# Altium schematic sheet Power.SchDoc: 5R Supply
size Tabloid; DocumentNumber: LM-008; Revision: C; SheetNumber: 3; SheetTotal: 6
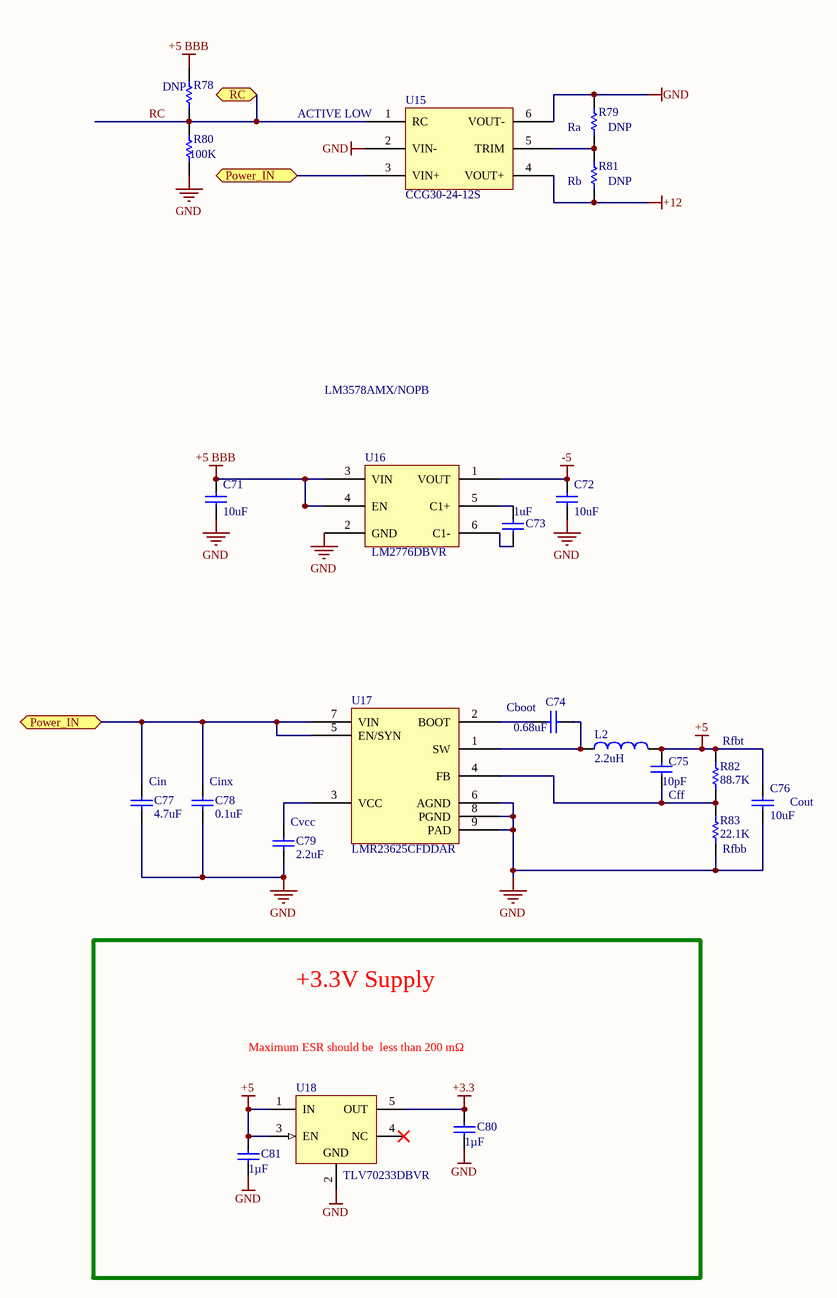
[diagram p0: Power.SchDoc]

## Parts
C71  10uF  [CAPC0805(2012)145_N]
C72  10uF  [CAPC0805(2012)145_N]
C73  1uF  [CAPC0805(2012)145_N]
C74  0.68uF  [1608[0603]]
C75  10pF  [CAPC0805(2012)145_N]
C76  10uF  [CAPC0805(2012)145_N]
C77  4.7uF  [C1210]
C78  0.1uF  [1608[0603]]
C79  2.2uF  [1608[0603]]
C80  Capacitance: 1µF  [CAPC1206(3216)130_N]  (hidden comment: CAP CER 1UF 50V X7R 1210)
C81  Capacitance: 1µF  [CAPC1206(3216)130_N]  (hidden comment: CAP CER 1UF 50V X7R 1210)
L2  2.2uH  [PA4332]
R78  DNP  [RESC0805(2012)_M]
R79  DNP  [RESC0805(2012)_M]
R80  Resistance: 100K  [RESC0805(2012)_M]  (hidden comment: RES SMD 100K OHM 1% 1/8W 0805)
R81  DNP  [RESC0805(2012)_M]
R82  88.7K  [RESC0805(2012)_M]
R83  22.1K  [RESC0805(2012)_M]
U15  CCG30-24-12S  [PXB15-24WD05/N]
U16  LM2776DBVR  [LM2776DBVR]
U17  LMR23625CFDDAR  [LMR23625CDDAR]
U18  TLV70233DBVR  [DBV0005A_N]

## Blocks framed on the sheet
+3.3V Supply: C80 C81 U18

## Ports
Power_IN, RC

## Nets
+3.3: C80.2 U18.5(OUT)
+5: C75.1 C76.1 C81.2 L2.2 R82.2 U18.1(IN) U18.3(EN)
+5 BBB: C71.1 R78.1 U16.3(VIN) U16.4(EN)
+12: R81.1 U15.4(VOUT+)
-5: C72.1 U16.1(VOUT)
GND: C71.2 C72.2 C76.2 C77.1 C78.1 C79.1 C80.1 C81.1 R79.2 R80.2 R83.1 U15.2(VIN-) U15.6(VOUT-) U16.2(GND) U17.6(AGND) U17.8(PGND) U17.9(PAD) U18.2(GND)
Power_IN: C77.2 C78.2 U15.3(VIN+) U17.5(EN/SYN) U17.7(VIN) ; port Power_IN
RC: R78.2 R80.1 U15.1(RC) ; port RC
NetC73_1: C73.1 U16.5(C1+)
NetC73_2: C73.2 U16.6(C1-)
NetC74_1: C74.1 U17.2(BOOT)
NetC74_2: C74.2 L2.1 U17.1(SW)
NetC75_2: C75.2 R82.1 R83.2 U17.4(FB)
NetC79_2: C79.2 U17.3(VCC)
NetR79_1: R79.1 R81.2 U15.5(TRIM)

Not connected (* = marked no-connect by the designer): U18 4(NC)*

## Notes on the sheet
- (near U15) ACTIVE LOW
- (near R79) Ra
- (near R81) Rb
- LM3578AMX/NOPB
- (near C74) Cboot
- (near R82) Rfbt
- (near C77) Cin
- (near C78) Cinx
- (near C79) Cvcc
- (near C75) Cff
- (near C76) Cout
- (near R83) Rfbb
- Maximum ESR should be  less than 200 mΩ
- Title
- Size:
- Date:
- Tabloid
- Number:
- Time:
- Revision:
- Sheet
- of
- ZLS Corporation
- 7801 North Lamar Blvd.
- Suite E-184
- Austin, Texas 78752  USA
- (512) 453-0288
- File:

## Library data of the parts
C71 C72 C76 = CMP-1036-04795-1: CAP CER 10UF 16V X6S 0805; Manufacturer: TDK Corporation; Manufacturer Part Number: C2012X6S1C106K085AC; Tolerance: ±10%; Notification: Current market demand for these product types have resulted in fluctuating and extending lead times. Lead times may differ.; Supplier 1: Digi-Key; Supplier Part Number 1: 445-14483-6-ND; RoHS: RoHS Compliant; Category: Capacitors; Stock 1: 0; Pricing 1: 1=0.38, 10=0.259, 100=0.1466, 500=0.1035, 1000=0.09056 (USD); Packaging: Digi-Reel®; Part Status: Active; Voltage - Rated: 16V; Temperature Coefficient: X6S; Operating Temperature: -55°C ~ 105°C; Features: Low ESL; Ratings: -; Applications: General Purpose; Failure Rate: -; Mounting Type: Surface Mount, MLCC; Package / Case: 0805 (2012 Metric); Size / Dimension: 0.079" L x 0.049" W (2.00mm x 1.25mm); Height - Seated (Max): -; Thickness (Max): 0.039" (1.00mm); Lead Spacing: -; Lead Style: -; ComponentLink1URL: https://product.tdk.com/info/en/catalog/datasheets/mlcc_commercial_general_en.pdf; ComponentLink1Description: https://product.tdk.com/info/en/catalog/datasheets/mlcc_commercial_general_en.pdf
C73 = CMP-1036-04795-1: CAP CER 1UF 25V X7R 0805; Manufacturer: Yageo; Manufacturer Part Number: CC0805KKX7R6BB105; Tolerance: ±10%; Voltage - Rated: 10V; Notification: Current market demand for these product types have resulted in fluctuating and extending lead times. Lead times may differ.; Supplier 1: Digi-Key; Supplier Part Number 1: 311-1458-6-ND; RoHS: RoHS Compliant; Category: Capacitors; Stock 1: 30000; Pricing 1: 1=0.25, 10=0.168, 100=0.0852, 500=0.0583, 1000=0.05158 (USD); Packaging: Digi-Reel®; Part Status: Active; Temperature Coefficient: X7R; Operating Temperature: -55°C ~ 125°C; Features: -; Ratings: -; Applications: General Purpose; Failure Rate: -; Mounting Type: Surface Mount, MLCC; Package / Case: 0805 (2012 Metric); Size / Dimension: 0.079" L x 0.049" W (2.00mm x 1.25mm); Height - Seated (Max): -; Thickness (Max): 0.057" (1.45mm); Lead Spacing: -; Lead Style: -; ComponentLink1URL: http://www.yageo.com/documents/recent/UPY-GPHC_X7R_6.3V-to-50V_18.pdf; ComponentLink1Description: http://www.yageo.com/documents/recent/UPY-GPHC_X7R_6.3V-to-50V_18.pdf
C74 = Cap Semi: CAP CER 0.68UF 50V X5R 0603; Manufacturer: TDK Corporation; Manufacturer Part Number: C1608X5R1H684K080AB; Tolerance: ±10%; Notification: Current market demand for these product types have resulted in fluctuating and extending lead times. Lead times may differ.; Supplier 1: Digi-Key; Supplier Part Number 1: 445-7466-6-ND; RoHS: RoHS Compliant; Category: Capacitors; Stock 1: 40000; Pricing 1: 1=0.24, 10=0.162, 100=0.0819, 500=0.05606, 1000=0.04959 (USD); Packaging: Digi-Reel®; Part Status: Not For New Designs; Voltage - Rated: 50V; Temperature Coefficient: X5R; Operating Temperature: -55°C ~ 85°C; Features: Low ESL; Ratings: -; Applications: General Purpose; Failure Rate: -; Mounting Type: Surface Mount, MLCC; Package / Case: 0603 (1608 Metric); Size / Dimension: 0.063" L x 0.032" W (1.60mm x 0.80mm); Height - Seated (Max): -; Thickness (Max): 0.035" (0.90mm); Lead Spacing: -; Lead Style: -; ComponentLink1URL: https://product.tdk.com/info/en/catalog/datasheets/mlcc_commercial_general_en.pdf; ComponentLink1Description: https://product.tdk.com/info/en/catalog/datasheets/mlcc_commercial_general_en.pdf
C75 = CMP-1036-04795-1: CAP CER 10PF 16V C0G/NP0 0805; Manufacturer: KEMET; Manufacturer Part Number: C0805C100M4GACTU; Tolerance: ±20%; Temperature Coefficient: C0G, NP0; Notification: Current market demand for these product types have resulted in fluctuating and extending lead times. Lead times may differ.; Supplier 1: Digi-Key; Supplier Part Number 1: 399-9147-6-ND; RoHS: RoHS Compliant; Category: Capacitors; Stock 1: 7637; Pricing 1: 1=0.13, 10=0.092, 100=0.0409, 500=0.02918, 1000=0.02293 (USD); Packaging: Digi-Reel®; Part Status: Active; Voltage - Rated: 16V; Operating Temperature: -55°C ~ 125°C; Features: Low ESL; Ratings: -; Applications: General Purpose; Failure Rate: -; Mounting Type: Surface Mount, MLCC; Package / Case: 0805 (2012 Metric); Size / Dimension: 0.079" L x 0.049" W (2.00mm x 1.25mm); Height - Seated (Max): -; Thickness (Max): 0.035" (0.88mm); Lead Spacing: -; Lead Style: -; ComponentLink1URL: https://api.kemet.com/component-edge/download/datasheet/C0805C100M4GACTU.pdf; ComponentLink1Description: https://api.kemet.com/component-edge/download/datasheet/C0805C100M4GACTU.pdf
C77 = Cap Semi: CAP CER 4.7UF 50V X7R 1210; Manufacturer: Murata Electronics North America; Manufacturer Part Number: GRM32ER71H475KA88L; Tolerance: ±10%; Notification: Current market demand for these product types have resulted in fluctuating and extending lead times. Lead times may differ.; Published: 8-Jun-2000; LatestRevisionDate: 29-May-2009; LatestRevisionNote: IPC-7351 Footprint Added.; PackageReference: C1206; Publisher: Altium Limited; PackageDescription: Chip Capacitor; Supplier 1: Digi-Key; Supplier Part Number 1: 490-1864-6-ND; RoHS: RoHS Compliant; Category: Capacitors; Stock 1: 10000; Pricing 1: 1=1.66, 10=1.313, 100=0.9849, 500=0.74414 (USD); Packaging: Digi-Reel®; Part Status: Not For New Designs; Voltage - Rated: 50V; Temperature Coefficient: X7R; Operating Temperature: -55°C ~ 125°C; Features: -; Ratings: -; Applications: General Purpose; Mounting Type: Surface Mount, MLCC; Package / Case: 1210 (3225 Metric); Size / Dimension: 0.126" L x 0.098" W (3.20mm x 2.50mm); Height - Seated (Max): -; Thickness (Max): 0.106" (2.70mm); Lead Spacing: -; Lead Style: -; ComponentLink1URL: https://www.murata.com/~/media/webrenewal/support/library/catalog/products/capacitor/mlcc/c02e.ashx?la=en-us; ComponentLink1Description: https://www.murata.com/~/media/webrenewal/support/library/catalog/products/capacitor/mlcc/c02e.ashx?la=en-us
C78 = Cap Semi: CAP CER 0.1UF 50V X5R 0603; Manufacturer: TDK Corporation; Manufacturer Part Number: C1608X5R1H104K080AA; Tolerance: ±10%; Notification: Current market demand for these product types have resulted in fluctuating and extending lead times. Lead times may differ.; Supplier 1: Digi-Key; Supplier Part Number 1: 445-7456-6-ND; RoHS: RoHS Compliant; Category: Capacitors; Stock 1: 0; Pricing 1: 1=0.1, 10=0.074, 100=0.0331, 500=0.02366, 1000=0.0186 (USD); Packaging: Digi-Reel®; Part Status: Not For New Designs; Voltage - Rated: 50V; Temperature Coefficient: X5R; Operating Temperature: -55°C ~ 85°C; Features: Low ESL; Ratings: -; Applications: General Purpose; Failure Rate: -; Mounting Type: Surface Mount, MLCC; Package / Case: 0603 (1608 Metric); Size / Dimension: 0.063" L x 0.032" W (1.60mm x 0.80mm); Height - Seated (Max): -; Thickness (Max): 0.035" (0.90mm); Lead Spacing: -; Lead Style: -; ComponentLink1URL: https://product.tdk.com/info/en/catalog/datasheets/mlcc_commercial_general_en.pdf; ComponentLink1Description: https://product.tdk.com/info/en/catalog/datasheets/mlcc_commercial_general_en.pdf
C79 = Cap Semi: CAP CER 2.2UF 10V X7R 0603
C80 C81 = CMP-1037-04913-1: Manufacturer: Murata Electronics North America; Manufacturer Part Number: GRM32RR71H105KA01L; Tolerance: ±10%; Supplier 1: Digi-Key; Supplier Part Number 1: 490-1863-6-ND; RoHS: RoHS Compliant; Category: Capacitors; Stock 1: 66890; Pricing 1: 1=0.35, 10=0.242, 100=0.1449, 500=0.10868 (USD); Packaging: Digi-Reel®; Part Status: Active; Voltage - Rated: 50V; Temperature Coefficient: X7R; Operating Temperature: -55°C ~ 125°C; Features: -; Ratings: -; Applications: General Purpose; Mounting Type: Surface Mount, MLCC; Package / Case: 1210 (3225 Metric); Size / Dimension: 0.126" L x 0.098" W (3.20mm x 2.50mm); Height - Seated (Max): -; Thickness (Max): 0.079" (2.00mm); Lead Spacing: -; Lead Style: -; ComponentLink1URL: http://search.murata.co.jp/Ceramy/image/img/A01X/G101/ENG/GRM32RR71H105KA01-01.pdf; ComponentLink1Description: http://search.murata.co.jp/Ceramy/image/img/A01X/G101/ENG/GRM32RR71H105KA01-01.pdf
L2 = Inductor: FIXED IND 2.2UH 4.3A 48 MOHM SMD; Manufacturer: Pulse Electronics Power; Manufacturer Part Number: PA4332.222NLT; Type: Wirewound; Material - Core: Iron; Tolerance: ±20%; Current - Saturation: 6.1A; Shielding: Shielded; DC Resistance (DCR): 48 mOhm Max; Frequency - Self Resonant: 25MHz; Supplier 1: Digi-Key; Supplier Part Number 1: 553-3290-6-ND; RoHS: RoHS Compliant; Category: Inductors, Coils, Chokes; Stock 1: 4798; Pricing 1: 1=0.64, 10=0.564, 100=0.4025, 500=0.3381, 1000=0.2737 (USD); Packaging: Digi-Reel®; Part Status: Active; Q @ Freq: -; Ratings: -; Operating Temperature: -40°C ~ 125°C; Features: -; Mounting Type: Surface Mount; Package / Case: Nonstandard; Supplier Device Package: -; Size / Dimension: 0.165" L x 0.165" W (4.20mm x 4.20mm); Height - Seated (Max): 0.079" (2.00mm); ComponentLink1URL: http://products.pulseelex.com/files/product_files/P761.pdf; ComponentLink1Description: http://products.pulseelex.com/files/product_files/P761.pdf
R78 = CMP-1013-00017-1: RES SMD 100K OHM 1% 1/8W 0805; Manufacturer: Vishay; Manufacturer Part Number: CRCW0805100KFKEA; Temperature Coefficient: 100ppm/°C; Power Rating: 125mW; Voltage Rating: 150V; Supplier 1: Avnet; Supplier Part Number 1: CRCW0805100KFKEA/BKN; Stock 1: 1317; Pricing 1: 1=0.1, 10=0.049, 25=0.042, 50=0.035, 100=0.028 (USD); Mount: Surface Mount; Case/Package: 0805; Number of Pins: 2; Weight: 0.000194oz; Contact Plating: Tin; Case Code (Imperial): 0805; Case Code (Metric): 2012; Min Operating Temperature: -55°C; Max Operating Temperature: 155°C; Tolerance: 1%; Composition: Thick Film; Resistance: 100K; Termination: SMD/SMT; Packaging: Tape and Reel; Package Quantity: 5000; Military Standard: Not; Voltage Rating (DC): 150V; Length: 2mm; Height: 0.45mm; Width: 1.25mm; Depth: 1.25mm; Radiation Hardening: No; Lead Free: Lead Free; REACH SVHC: Unknown; ComponentLink1URL: https://datasheet.ciiva.com/11809/0900766b80d98b26-11809057.pdf; ComponentLink1Description: https://datasheet.ciiva.com/11809/0900766b80d98b26-11809057.pdf; ComponentLink2URL: https://datasheet.ciiva.com/7777/1697337-7777349.pdf; ComponentLink2Description: https://datasheet.ciiva.com/7777/1697337-7777349.pdf; ComponentLink3URL: https://datasheet.ciiva.com/3258/dcrcwe3-3258006.pdf; ComponentLink3Description: https://datasheet.ciiva.com/3258/dcrcwe3-3258006.pdf; ComponentLink4URL: https://datasheet.ciiva.com/16754/70201119-16754822.pdf; ComponentLink4Description: https://datasheet.ciiva.com/16754/70201119-16754822.pdf; ComponentLink5URL: https://datasheet.ciiva.com/8337/dcrcwe3-8337738.pdf; ComponentLink5Description: https://datasheet.ciiva.com/8337/dcrcwe3-8337738.pdf; ComponentLink6URL: https://datasheet.ciiva.com/16341/dcrcwe3-16341530.pdf; ComponentLink6Description: https://datasheet.ciiva.com/16341/dcrcwe3-16341530.pdf; ComponentLink7URL: https://datasheet.ciiva.com/16852/dcrcwe3-16852810.pdf; ComponentLink7Description: https://datasheet.ciiva.com/16852/dcrcwe3-16852810.pdf; ComponentLink8URL: https://datasheet.ciiva.com/16720/70201119-16720891.pdf; ComponentLink8Description: https://datasheet.ciiva.com/16720/70201119-16720891.pdf; ComponentLink9URL: https://datasheet.ciiva.com/7777/1720486-7777565.pdf; ComponentLink9Description: https://datasheet.ciiva.com/7777/1720486-7777565.pdf
R79 = CMP-1013-00017-1: Vout = 12.05 ­ (445.7 / 63.1+Ra)
R80 = CMP-1013-00017-1: Manufacturer: Vishay; Manufacturer Part Number: CRCW0805100KFKEA; Temperature Coefficient: 100ppm/°C; Power Rating: 125mW; Voltage Rating: 150V; Supplier 1: Avnet; Supplier Part Number 1: CRCW0805100KFKEA/BKN; Stock 1: 1317; Pricing 1: 1=0.1, 10=0.049, 25=0.042, 50=0.035, 100=0.028 (USD); Mount: Surface Mount; Case/Package: 0805; Number of Pins: 2; Weight: 0.000194oz; Contact Plating: Tin; Case Code (Imperial): 0805; Case Code (Metric): 2012; Min Operating Temperature: -55°C; Max Operating Temperature: 155°C; Tolerance: 1%; Composition: Thick Film; Termination: SMD/SMT; Packaging: Tape and Reel; Package Quantity: 5000; Military Standard: Not; Voltage Rating (DC): 150V; Length: 2mm; Height: 0.45mm; Width: 1.25mm; Depth: 1.25mm; Radiation Hardening: No; Lead Free: Lead Free; REACH SVHC: Unknown; ComponentLink1URL: https://datasheet.ciiva.com/11809/0900766b80d98b26-11809057.pdf; ComponentLink1Description: https://datasheet.ciiva.com/11809/0900766b80d98b26-11809057.pdf; ComponentLink2URL: https://datasheet.ciiva.com/7777/1697337-7777349.pdf; ComponentLink2Description: https://datasheet.ciiva.com/7777/1697337-7777349.pdf; ComponentLink3URL: https://datasheet.ciiva.com/3258/dcrcwe3-3258006.pdf; ComponentLink3Description: https://datasheet.ciiva.com/3258/dcrcwe3-3258006.pdf; ComponentLink4URL: https://datasheet.ciiva.com/16754/70201119-16754822.pdf; ComponentLink4Description: https://datasheet.ciiva.com/16754/70201119-16754822.pdf; ComponentLink5URL: https://datasheet.ciiva.com/8337/dcrcwe3-8337738.pdf; ComponentLink5Description: https://datasheet.ciiva.com/8337/dcrcwe3-8337738.pdf; ComponentLink6URL: https://datasheet.ciiva.com/16341/dcrcwe3-16341530.pdf; ComponentLink6Description: https://datasheet.ciiva.com/16341/dcrcwe3-16341530.pdf; ComponentLink7URL: https://datasheet.ciiva.com/16852/dcrcwe3-16852810.pdf; ComponentLink7Description: https://datasheet.ciiva.com/16852/dcrcwe3-16852810.pdf; ComponentLink8URL: https://datasheet.ciiva.com/16720/70201119-16720891.pdf; ComponentLink8Description: https://datasheet.ciiva.com/16720/70201119-16720891.pdf; ComponentLink9URL: https://datasheet.ciiva.com/7777/1720486-7777565.pdf; ComponentLink9Description: https://datasheet.ciiva.com/7777/1720486-7777565.pdf
R81 = CMP-1013-00017-1: Vout = 12.05 + (50.96 / 22+Rb)
R82 = CMP-1013-00017-1: RES SMD 88.7K OHM 1% 1/8W 0805; Manufacturer: Vishay Dale; Manufacturer Part Number: CRCW080588K7FKEA; Power (Watts): 0.125W, 1/8W; Temperature Coefficient: ±100ppm/°C; Supplier 1: Digi-Key; Supplier Part Number 1: 541-88.7KCDKR-ND; RoHS: RoHS Compliant; Category: Resistors; Stock 1: 66; Pricing 1: 1=0.1, 10=0.055, 100=0.0223, 1000=0.01003, 2500=0.0087 (USD); Packaging: Digi-Reel®; Part Status: Active; Tolerance: ±1%; Composition: Thick Film; Features: Automotive AEC-Q200; Operating Temperature: -55°C ~ 155°C; Package / Case: 0805 (2012 Metric); Supplier Device Package: 0805; Size / Dimension: 0.079" L x 0.049" W (2.00mm x 1.25mm); Height - Seated (Max): 0.020" (0.50mm); Failure Rate: -; ComponentLink1URL: http://www.vishay.com/docs/20035/dcrcwe3.pdf; ComponentLink1Description: http://www.vishay.com/docs/20035/dcrcwe3.pdf
R83 = CMP-1013-00017-1: RES SMD 22.1K OHM 1% 1/8W 0805; Manufacturer: Vishay Dale; Manufacturer Part Number: CRCW080522K1FKEA; Power (Watts): 0.125W, 1/8W; Temperature Coefficient: ±100ppm/°C; Supplier 1: Digi-Key; Supplier Part Number 1: 541-22.1KCDKR-ND; RoHS: RoHS Compliant; Category: Resistors; Stock 1: 1994; Pricing 1: 1=0.1, 10=0.055, 100=0.0223, 1000=0.01003, 2500=0.0087 (USD); Packaging: Digi-Reel®; Part Status: Active; Tolerance: ±1%; Composition: Thick Film; Features: Automotive AEC-Q200; Operating Temperature: -55°C ~ 155°C; Package / Case: 0805 (2012 Metric); Supplier Device Package: 0805; Size / Dimension: 0.079" L x 0.049" W (2.00mm x 1.25mm); Height - Seated (Max): 0.020" (0.50mm); Failure Rate: -; ComponentLink1URL: http://www.vishay.com/docs/20035/dcrcwe3.pdf; ComponentLink1Description: http://www.vishay.com/docs/20035/dcrcwe3.pdf
U15 = CCG302412S: DC DC CONVERTER 12V 30W; Manufacturer: TDK-Lambda Americas Inc.; Voltage - Input (Min): 9V; Voltage - Input (Max): 36V; Current - Output (Max): 2.5A; Efficiency: 89%; Control Features: Enable, Active Low; Supplier 1: Digi-Key; Manufacturer Part Number: CCG302412S; RoHS: RoHS Compliant; Category: Power Supplies - Board Mount; Stock 1: 269; Pricing 1: 1=41.1, 10=40.25 (USD); Packaging: Tray; Part Status: Active; Type: Isolated Module; Voltage - Output 1: 12V; Voltage - Output 2: -; Voltage - Output 3: -; Applications: ITE (Commercial); Features: Remote On/Off, OCP, OVP; Operating Temperature: -40°C ~ 85°C; Mounting Type: Through Hole; Package / Case: 6-DIP Module; Size / Dimension: 1.00" L x 1.00" W x 0.39" H (25.4mm x 25.4mm x 9.9mm); ComponentLink1URL: http://www.us.tdk-lambda.com/ftp/specs/ccg30.pdf; ComponentLink1Description: http://www.us.tdk-lambda.com/ftp/specs/ccg30.pdf; Supplier Part Number 1: 285-2419-ND
U16 = LM2776DBVR: IC REG SWTCHD CAP INV 6SOT23; Manufacturer: Texas Instruments; Function: Ratiometric; Output Configuration: Negative; Topology: Charge Pump; Output Type: Fixed; Number of Outputs: 1; Voltage - Input (Min): 2.7V; Voltage - Input (Max): 5.5V; Voltage - Output (Min/Fixed): -Vin; Current - Output: 200mA; Frequency - Switching: 2MHz; Synchronous Rectifier: No; Supplier 1: Digi-Key; Supplier Part Number 1: 296-43957-6-ND; Manufacturer Part Number: LM2776DBVR; RoHS: RoHS Compliant; Category: Integrated Circuits (ICs); Stock 1: 13045; Pricing 1: 1=1.05, 10=0.936, 100=0.7297, 500=0.60276, 1000=0.47586 (USD); Packaging: Digi-Reel®; Part Status: Active; Voltage - Output (Max): -; Operating Temperature: -40°C ~ 85°C (TA); Mounting Type: Surface Mount; Package / Case: SOT-23-6; Supplier Device Package: SOT-23-6; ComponentLink1URL: http://www.ti.com/lit/ds/symlink/lm2776.pdf; ComponentLink1Description: http://www.ti.com/lit/ds/symlink/lm2776.pdf
U17 = LMR23625CDDAR: IC REG BUCK ADJ 2.5A SYNC 8SOPWR; Manufacturer: Texas Instruments; Function: Step-Down; Output Configuration: Positive; Output Type: Adjustable; Number of Outputs: 1; Voltage - Input (Min): 4.5V; Voltage - Input (Max): 36V; Voltage - Output (Min/Fixed): 1V; Voltage - Output (Max): 28V; Frequency - Switching: 2.1MHz; Synchronous Rectifier: Yes; Supplier 1: Digi-Key; Supplier Part Number 1: 296-47269-1-ND; Manufacturer Part Number: LMR23625CFDDAR; RoHS: RoHS Compliant; Category: Integrated Circuits (ICs); Stock 1: 2378; Pricing 1: 1=3.24, 10=2.912, 100=2.3861, 500=2.03124, 1000=1.7131 (USD); Packaging: Cut Tape (CT); Part Status: Active; Topology: Buck; Current - Output: 2.5A; Operating Temperature: -40°C ~ 125°C (TJ); Mounting Type: Surface Mount; Package / Case: 8-PowerSOIC (0.154", 3.90mm Width); Supplier Device Package: 8-SO PowerPad; ComponentLink1URL: http://www.ti.com/lit/ds/symlink/lmr23625.pdf; ComponentLink1Description: http://www.ti.com/lit/ds/symlink/lmr23625.pdf
U18 = CMP-0394-00528-2: Single Output LDO, 300 mA, Fixed 3.3 V Output, 2 to 5.5 V Input, with Low IQ, 5-pin SOT-23 (DBV), -40 to 125 degC, Green (RoHS & no Sb/Br); Manufacturer: Texas Instruments; Output Configuration: Positive; Voltage - Input (Max): 5.5V; Voltage - Output (Min/Fixed): 3.3V; Voltage Dropout (Max): 0.38V @ 300mA; Current - Output: 300mA; PSRR: 68dB (1kHz); Control Features: Enable; Protection Features: Over Current, Over Temperature, Reverse Polarity, Under Voltage Lockout (UVLO); Supplier 1: Digi-Key; Supplier Part Number 1: 296-32415-1-ND; Manufacturer Part Number: TLV70233DBVR; RoHS: RoHS Compliant; Category: Integrated Circuits (ICs); Stock 1: 65852; Pricing 1: 1=0.51, 10=0.44, 100=0.3288, 500=0.25832, 1000=0.19961 (USD); Packaging: Cut Tape (CT); Part Status: Active; Output Type: Fixed; Voltage - Output (Max): -; Operating Temperature: -40°C ~ 125°C; Mounting Type: Surface Mount; Package / Case: SC-74A, SOT-753; Supplier Device Package: SOT-23-5; Base Part Number: TLV70233; ComponentLink1URL: http://www.ti.com/lit/ds/symlink/tlv702.pdf; ComponentLink1Description: http://www.ti.com/lit/ds/symlink/tlv702.pdf